# Altium project ZLS-027.PrjPcb
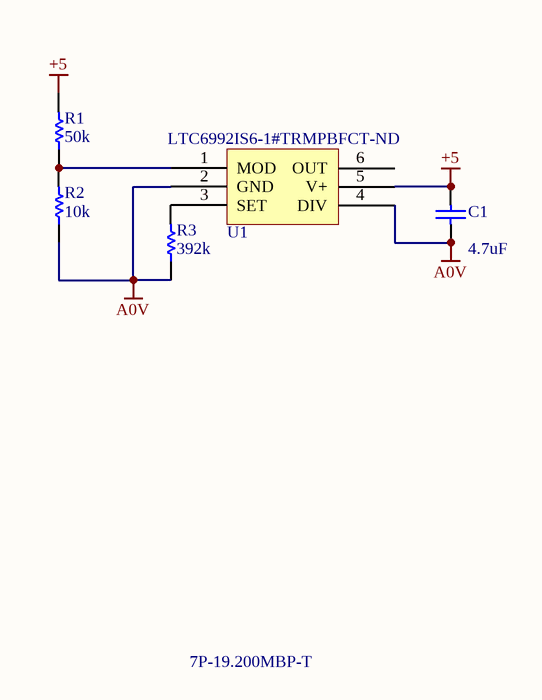
[diagram p0: ZLS-027.SchDoc]
1 sheet, 5 parts. Net scope: global (net labels, ports and power ports of the same name join across sheets).
Board file: ZLS-027.PcbDoc

## Sheet ZLS-027.SchDoc
size OrCAD A

### Parts
C1  value 4.7uF  [CAPC1206(3216)110_N]
R1  Resistance (Ohms): 50k  [RESC0805(2012)_M]  (hidden comment: RES SMD 43K OHM 1% 1/8W 0805)
R2  Resistance (Ohms): 10k  [RESC0805(2012)_M]  (hidden comment: RES SMD 43K OHM 1% 1/8W 0805)
R3  Resistance (Ohms): 392k  [RESC0805(2012)_M]  (hidden comment: RES SMD 43K OHM 1% 1/8W 0805)
U1  Supplier Part Number 1: LTC6992IS6-1#TRMPBFCT-ND  [SOT95P280X445-6N]  (hidden comment: LTC6992)

### Nets
+5: C1.2 R1.2 U1.5(V+)
A0V: C1.1 R2.1 R3.1 U1.2(GND) U1.4(DIV)
NetR1_1: R1.1 R2.2 U1.1(MOD)
NetR3_2: R3.2 U1.3(SET)

Not connected (* = marked no-connect by the designer): U1 6(OUT)

### Notes on the sheet
- 7P-19.200MBP-T
- Title
- Size:
- Date:
- Orcad A
- Number:
- Time:
- Revision:
- Sheet
- of
- ZLS Corporation
- 7801 North Lamar Blvd.
- Suite E-184
- Austin, Texas 78752  USA
- (512) 453-0288
- File:

### Library data of the parts
C1 = CMP-1037-04332-1
R1-R3 = CMP-1013-00017-1: RES SMD 10K OHM 1% 1/8W 0805
U1 = LTC6992: Manufacturer: Linear Technology/Analog Devices; Manufacturer Part Number: LTC6992IS6-1#TRMPBF; Description: IC OSC SILICON PROG TSOT23-6; Frequency: 3.81Hz ~ 1MHz; Voltage - Supply: 2.25 V ~ 5.5 V; Supplier 1: Digi-Key; RoHS: RoHS Compliant; Category: Integrated Circuits (ICs); Stock 1: 573; Pricing 1: 1=4.48, 25=3.998, 100=2.5459, 250=2.33376 (USD); Packaging: Cut Tape (CT); Part Status: Active; Type: Oscillator, Silicon; Count: -; Operating Temperature: -40°C ~ 85°C; Package / Case: SOT-23-6 Thin, TSOT-23-6; Supplier Device Package: TSOT-23-6; Mounting Type: Surface Mount; Base Part Number: LTC6992-1; ComponentLink1URL: http://www.linear.com/docs/29337; ComponentLink1Description: http://www.linear.com/docs/29337